# EAGLE design backpac_b (EAGLE 5.12)
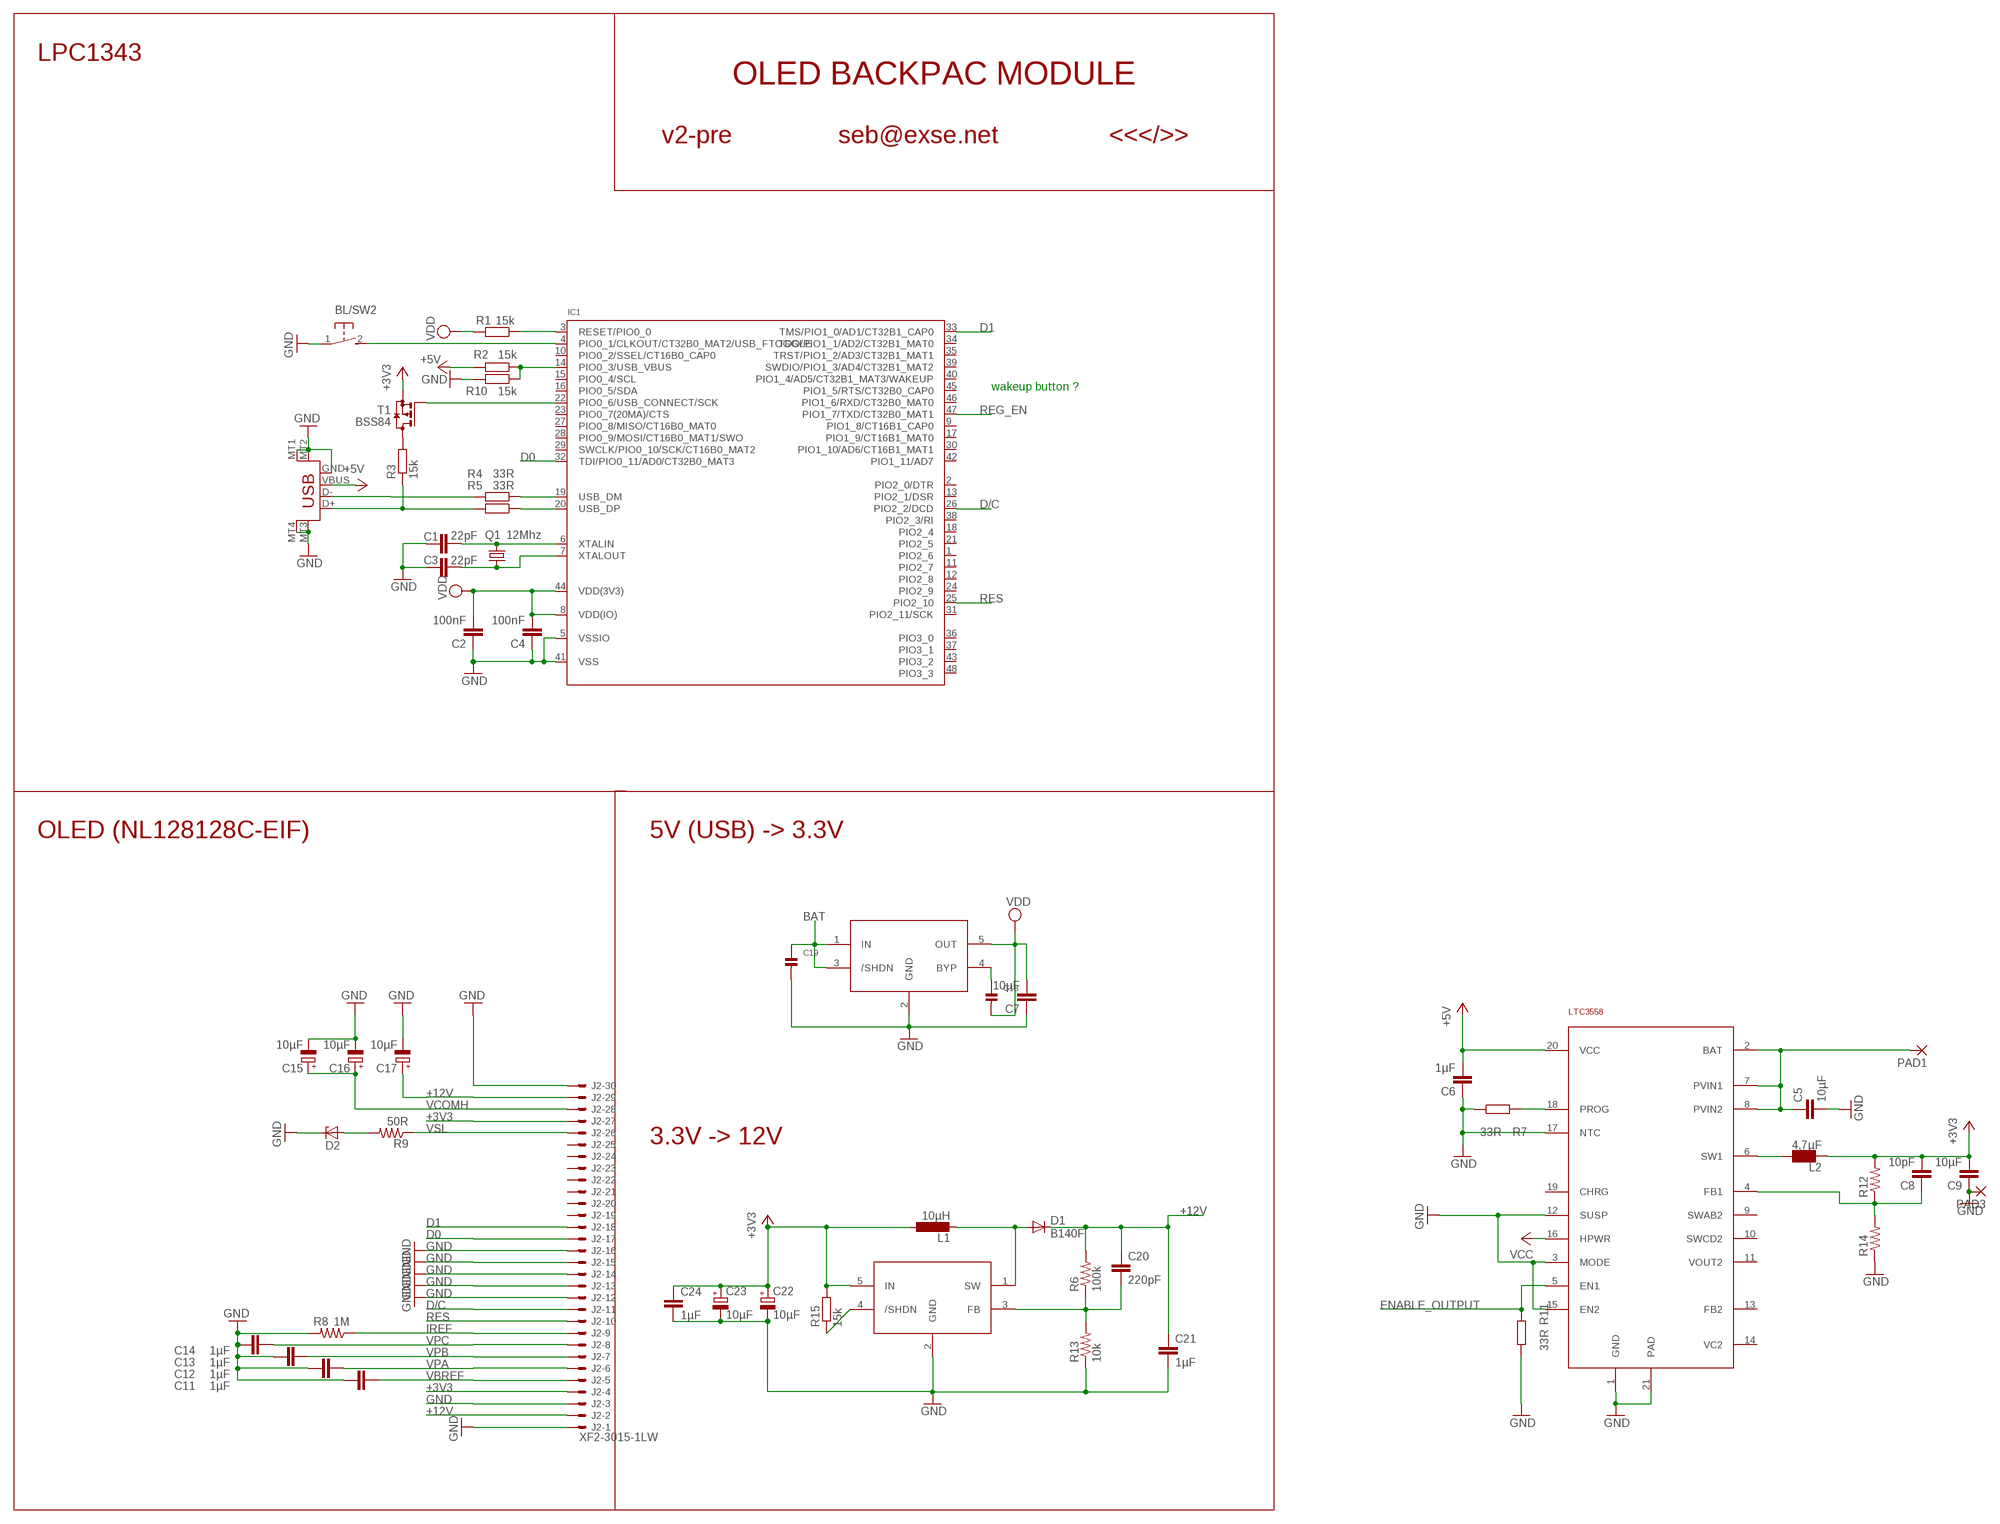
[diagram p0: schematic, sheet 1]

## Parts
BL/SW2  SWITCH_MCTAEF  [SWITCH_MCTAEF]
C1  22pF  C-EUC0402  [C0402]
C2  100nF  C-EUC0402  [C0402]
C3  22pF  C-EUC0402  [C0402]
C4  100nF  C-EUC0402  [C0402]
C5  10µF  CAP0805  [0805]
C6  1µF  CAP0805  [0805]
C7  10µF  CAP0805  [0805]
C8  10pF  CAP0805  [0805]
C9  10µF  CAP0805  [0805]
C11  1µF  CAP0805  [0805]
C12  1µF  CAP0805  [0805]
C13  1µF  CAP0805  [0805]
C14  1µF  CAP0805  [0805]
C15  10µF  CPOL-EUSMCA  [SMC_A]
C16  10µF  CPOL-EUSMCA  [SMC_A]
C17  10µF  CPOL-EUSMCA  [SMC_A]
C18  CAP_CERAMIC0603MINI  [0603-MINI]
C19  CAP_CERAMIC0603MINI  [0603-MINI]
C20  220pF  CAP0805  [0805]
C21  1µF  CAP0805  [0805]
C22  10µF  CPOL-EUSMCA  [SMC_A]
C23  10µF  CPOL-EUSMCA  [SMC_A]
C24  1µF  CAP0805  [0805]
D1  B140F  DIODE-DO214AC  [DO214AC]
D2  ZENER-DIODESOT23  [SOT23]
IC1  LPC1343_QFP  [LQFP48]
IC2  LTC3558  [UD-QFN20]
IC3  LT1761  [SOT23-5L]
IC4  LM27313  [SOT23-5L]
J2  XF2-3015-1LW  [XF2H-3015-1LW]
L1  10µH  L-EUL1812  [L1812]
L2  4,7µF  VLF4012A  [VLF4012A]
PAD1  SMD2  [SMD1,27-2,54]
PAD3  SMD2  [SMD1,27-2,54]
Q1  12Mhz  MT-OSCILLATOR  [MT]
R1  15k  R-EU_R0402  [R0402]
R2  15k  R-EU_R0402  [R0402]
R3  15k  R-EU_R0402  [R0402]
R4  33R  R-EU_R0402  [R0402]
R5  33R  R-EU_R0402  [R0402]
R6  100k  RESISTOR0805-RES  [0805]
R7  33R  R-EU_R0402  [R0402]
R8  1M  RESISTOR0805-RES  [0805]
R9  50R  RESISTOR0805-RES  [0805]
R10  15k  R-EU_R0402  [R0402]
R11  33R  R-EU_R0402  [R0402]
R12  RESISTOR0805-RES  [0805]
R13  10k  RESISTOR0805-RES  [0805]
R14  RESISTOR0805-RES  [0805]
R15  15k  R-EU_R0402  [R0402]
T1  BSS84  [SOT23]
X1  USB-MICROB  [USB-MICROB]

## Nets
+3V3: C8.2 C9.2 C22.+ C23.+ C24.1 IC4.5(IN) J2.4 J2.27 L1.1 L2.P$4 R12.2 R15.2 T1.2(S)
+5V: C6.2 IC2.20(VCC) R2.2 X1.VBUS
+12V: C17.+ C20.1 C21.1 D1.C J2.2 J2.29 R6.2
BAT: C5.1 C19.1 IC2.2(BAT) IC2.7(PVIN1) IC2.8(PVIN2) IC3.1(IN) IC3.3(/SHDN) PAD1.1(P)
D0: IC1.32(TDI/PIO0_11/AD0/CT32B0_MAT3) J2.17
D1: IC1.33(TMS/PIO1_0/AD1/CT32B1_CAP0) J2.18
D/C: IC1.26(PIO2_2/DCD) J2.11
ENABLE_OUTPUT: IC2.5(EN1) R11.2
GND: BL/SW2.1 C1.1 C2.1 C3.1 C4.1 C5.2 C6.1 C7.1 C9.1 C11.1 C12.1 C13.1 C14.1 C15.- C16.- C17.- C19.2 C21.2 C22.- C23.- C24.2 D2.3(C) IC1.5(VSSIO) IC1.41(VSS) IC2.1(GND) IC2.3(MODE) IC2.12(SUSP) IC2.15(EN2) IC2.17(NTC) IC2.21(PAD) IC3.2(GND) IC4.2(GND) J2.1 J2.3 J2.12 J2.13 J2.14 J2.15 J2.16 J2.30 PAD3.1(P) R7.1 R8.2 R10.2 R11.1 R13.1 R14.1 X1.GND X1.MT1(GND) X1.MT2(GND) X1.MT3(GND) X1.MT4(GND)
IREF: J2.9 R8.1
N$1: IC2.18(PROG) R7.2
N$2: D2.1(A) R9.2
N$3: C3.2 IC1.7(XTALOUT) Q1.1
N$4: C1.2 IC1.6(XTALIN) Q1.3
N$5: D1.A IC4.1(SW) L1.2
N$6: C20.2 IC4.3(FB) R6.1 R13.2
N$7: IC1.3(RESET/PIO0_0) R1.1
N$8: R3.2 T1.3(D)
N$9: IC1.22(PIO0_6/USB_CONNECT/SCK) T1.1(G)
N$10: R3.1 R5.2 X1.D+
N$11: R4.2 X1.D-
N$12: IC1.14(PIO0_3/USB_VBUS) R2.1 R10.1
N$13: C8.1 IC2.4(FB1) R12.1 R14.2
N$14: IC1.19(USB_DM) R4.1
N$15: IC2.6(SW1) L2.P$3
N$21: BL/SW2.2 IC1.4(PIO0_1/CLKOUT/CT32B0_MAT2/USB_FTOGGLE)
N$24: IC1.20(USB_DP) R5.1
N$43: C18.1 IC3.4(BYP)
REG_EN: IC1.47(PIO1_7/TXD/CT32B0_MAT1)
REG_EN_: IC4.4(/SHDN) R15.1
RES: IC1.25(PIO2_10) J2.10
VBREF: C11.2 J2.5
VCC: IC2.16(HPWR)
VCOMH: C15.+ C16.+ J2.28
VDD: C2.2 C4.2 C7.2 C18.2 IC1.8(VDD(IO)) IC1.44(VDD(3V3)) IC3.5(OUT) R1.2
VPA: C12.2 J2.6
VPB: C13.2 J2.7
VPC: C14.2 J2.8
VSL: J2.26 R9.1
Unconnected: IC1.1(PIO2_6) IC1.2(PIO2_0/DTR) IC1.9(PIO1_8/CT16B1_CAP0) IC1.10(PIO0_2/SSEL/CT16B0_CAP0) IC1.11(PIO2_7) IC1.12(PIO2_8) IC1.13(PIO2_1/DSR) IC1.15(PIO0_4/SCL) IC1.16(PIO0_5/SDA) IC1.17(PIO1_9/CT16B1_MAT0) IC1.18(PIO2_4) IC1.21(PIO2_5) IC1.23(PIO0_7(20MA)/CTS) IC1.24(PIO2_9) IC1.27(PIO0_8/MISO/CT16B0_MAT0) IC1.28(PIO0_9/MOSI/CT16B0_MAT1/SWO) IC1.29(SWCLK/PIO0_10/SCK/CT16B0_MAT2) IC1.30(PIO1_10/AD6/CT16B1_MAT1) IC1.31(PIO2_11/SCK) IC1.34(TDO/PIO1_1/AD2/CT32B1_MAT0) IC1.35(TRST/PIO1_2/AD3/CT32B1_MAT1) IC1.36(PIO3_0) IC1.37(PIO3_1) IC1.38(PIO2_3/RI) IC1.39(SWDIO/PIO1_3/AD4/CT32B1_MAT2) IC1.40(PIO1_4/AD5/CT32B1_MAT3/WAKEUP) IC1.42(PIO1_11/AD7) IC1.43(PIO3_2) IC1.45(PIO1_5/RTS/CT32B0_CAP0) IC1.46(PIO1_6/RXD/CT32B0_MAT0) IC1.48(PIO3_3) IC2.9(SWAB2) IC2.10(SWCD2) IC2.11(VOUT2) IC2.13(FB2) IC2.14(VC2) IC2.19(CHRG) J2.19 J2.20 J2.21 J2.22 J2.23 J2.24 J2.25

## Notes on the sheet
- LPC1343
- OLED BACKPAC MODULE
- v2-pre | seb@exse.net | <<</>>
- wakeup button ?
- OLED (NL128128C-EIF) | 5V (USB) -> 3.3V
- 3.3V -> 12V

## Library data of the parts
BL/SW2 = seb:SWITCH_MCTAEF
C1-C4 = rcl:C-EU: CAPACITOR, European symbol
C5-C9 C11-C14 C20 C21 C24 = SparkFun:CAP: Capacitor Standard 0603 ceramic capacitor, and 0.1" leaded capacitor.
C15-C17 C22 C23 = rcl:CPOL-EU: POLARIZED CAPACITOR, European symbol
C18 C19 = microbuilder:CAP_CERAMIC: Ceramic Capacitors 0402 - 0402 Surface Mount Capacitors 16pF 50V 5% [Digikey: 445-4899-2-ND] 18pF 50V 5% [Digikey: 490-1281-2-ND] 22pF 50V 5% [Digikey: 490-1283-2-ND] 68pF 50V 5% [Digikey: 490-1289-2-ND] 0.1uF 10V 10% [Digikey: 490-1318-2-ND] 1.0uF 6.3V 10% [Digikey: 490-1320-2-ND] 0603 - 0603 Surface Mount Capacitors 16 pF 50V 5% [Digikey: 445-5051-2-ND] 22 pF 50V [Digikey: PCC220ACVTR-ND] 33 pF 50V 5% [Digikey: 490-1415-1-ND] 56pF 50V 5% [Digikey: 490-1421-1-ND] 220pF 50V 5% [Digikey: 445-1285-1-ND] 680 pF 50V 2200 pF 50V 5% C0G [Digikey: 445-1297-1-ND] 5600 pF 100V 5% X7R [Digikey: 478-3711-1-ND] 0.1 µF 25V 10% [Digikey: PCC2277TR-ND] 0.22 µF 16V 10% X7R [Digikey: 445-1318-1-ND] 1.0 µF 25V 10% [Digikey: 445-5146-2-ND] 0603 - RF Specific 3pF 250V +/-0.1pF RF [Digikey: 712-1347-1-ND] 18 pF 250V 5% [Digikey: 478-3505-1-ND or 712-1322-1-ND] 56 pF 250V 5% C0G RF [Digikey: 490-4867-1-ND] 68 pF 250V RF [Digikey: 490-4868-1-ND] 0805 - 0805 Surface Mount Capacitors 220 pF 250V 2% RF Ceramic Capacitor [Digikey: 712-1398-1-ND] 1000 pF 50V 2% NP0 Ceramic Capacitor [Digikey: 478-3760-1-ND] 0.1 µF 25V 10% Ceramic Capacitor [Digikey: PCC1828TR-ND] 1.0 µF 16V 10% Ceramic Capacitor[Digikey: 490-1691-2-ND] 10.0 µF 10V 10% Ceramic Capacitor[Digikey: 709-1228-1-ND] 10.0 uF 16V 10% Ceramic Capacitor [Digikey: 478-5165-2-ND] 47 uF 6.3V 20% Ceramic Capacitor [Digikey: 587-1779-1-ND or 399-5506-1-ND] 1206 - 1206 Surface Mount Capacitors 47uF 10V 20% Ceramic Capacitor [Digikey: 490-5528-1-ND or 399-5508-1-ND or 445-6010-1-ND]
D1 = diode:DIODE-: DIODE
D2 = diode:ZENER-DIODE: Z-Diode
IC1 = microbuilder:LPC1343_QFP: LPC1343 72 MHz 32-bit ARM Cortex-M3 microcontroller. 32 kB Flash, 8 kB SRAM, USB Device Mouser: 771-LPC1343FBD48151 Digikey: 568-4945-ND; DIGIKEY#: 568-4945-ND; MANF: NXP; MANF#: LPC1343FBD48,151
IC2 = seb:LTC3558
IC3 = seb:LT1761
IC4 = seb:LM27313
J2 = con-omron:XF2*-30?: OMRON FPC Connector Source : http://www.omron.com/ecb/products/pdf/fpc.pdf; OC_FARNELL: unknown; OC_NEWARK: unknown
L1 = resistor:L-EU: INDUCTOR, European symbol
L2 = seb:VLF4012A
PAD1 PAD3 = wirepad:SMD2: SMD PAD
Q1 = seb:MT-OSCILLATOR
R1-R5 R7 R10 R11 R15 = rcl:R-EU_: RESISTOR, European symbol
R6 R8 R9 R12-R14 = SparkFun:RESISTOR: Resistor Basic schematic elements and footprints for 0603, 1206, and PTH resistors.
T1 = transistor-small-signal:BSS84: P-CHANNEL MOS FET
X1 = SparkFun:USB: USB Connectors USB-B-PTH is fully proven SKU : PRT-00139 USB-miniB is fully proven SKU : PRT-00587 USB-A-PCB is untested. USB-A-H is throughly reviewed, but untested. Spark Fun Electronics SKU : PRT-00437 USB-B-SMT is throughly reviewed, but untested. Needs silkscreen touching up. USB-A-S has not been used/tested USB-MB-H has not been used/tested

## Board
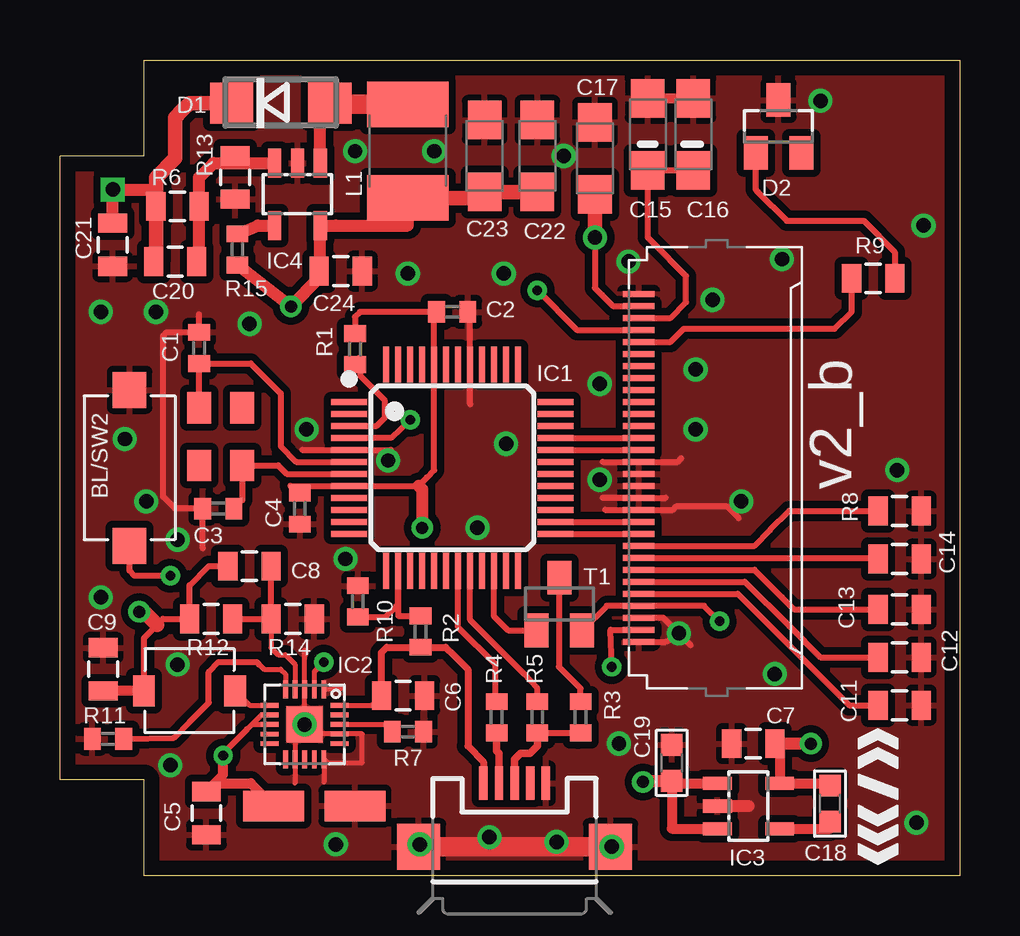
[diagram p1: board, top side]
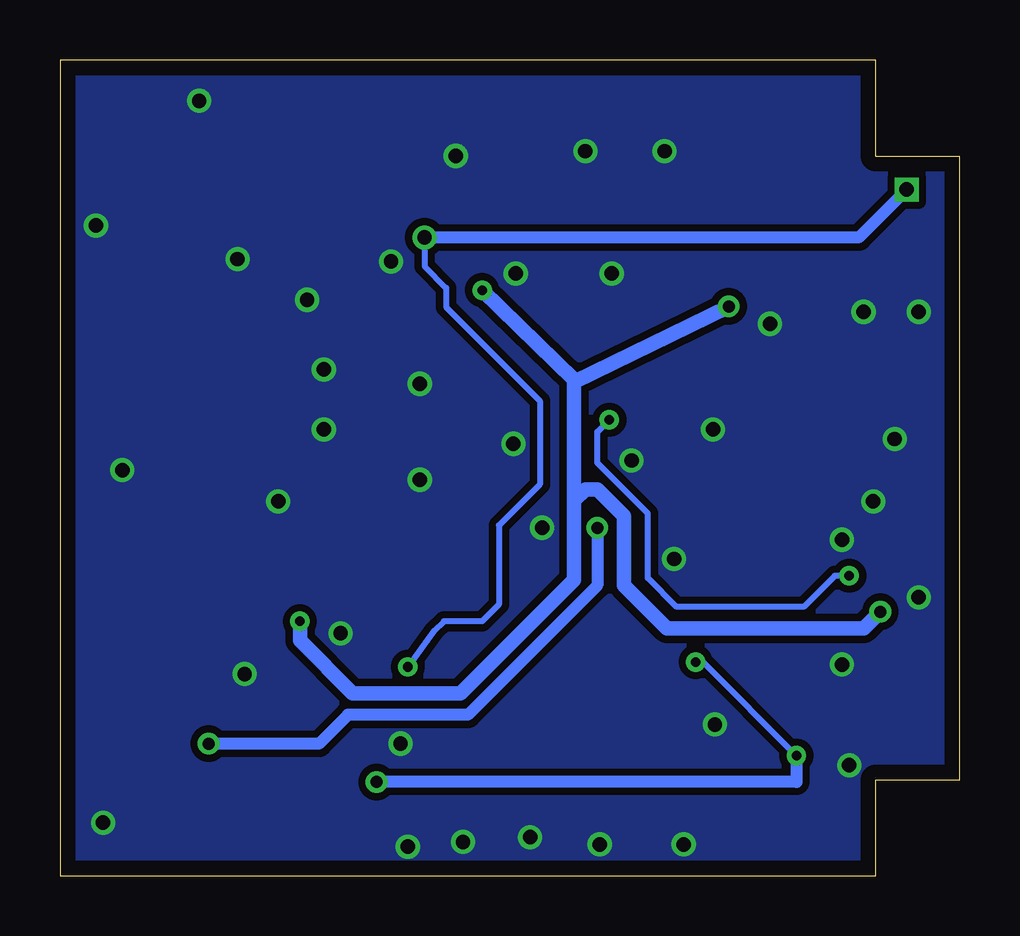
[diagram p2: board, bottom side, seen from below]

Size 37.5 x 34 mm. Coordinates in mm from the lower left corner, seen from the top.
Outline: 37.5,34 37.5,0 3.5,0 3.5,4 0,4 0,30 3.5,30 3.5,34 37.5,34
Copper layers (1*16): Top 0.035mm / dielectric 1.5mm / Bottom 0.035mm
Design rules "default *": minimum track width 9mil, minimum drill 0.4mm, track to track 8mil, track to pad 8mil, pad to pad 8mil, via to via 8mil, smd to smd 8mil, copper to edge 25mil, drill to drill 8mil, minimum pad ring 10mil, minimum via ring 8mil, stop-mask expansion 4mil, vias tented up to drill 30mil, thermal gap 10mil

### Footprints (pad centres in the part's own frame; a part is rotated, then mirrored left to right if it is on the bottom)
SWITCH_MCTAEF = smd 1.5 x 1.4: 1 -3.25,0; 2 3.25,0
C0402 = smd 0.7 x 0.9: 1 -0.65,0; 2 0.65,0
0805 = smd 0.8 x 1.2: 1 -0.9,0; 2 0.9,0
SMC_A = smd 1.6 x 1.4: + -1.5,0; - 1.5,0
0603-MINI = smd 0.9 x 0.9: 1 -0.75,0; 2 0.75,0
DO214AC = smd 1.8 x 1.7: A 2.05,0; C -2.05,0
SOT23 = smd 1 x 1.4: 1 -0.95,-1.1; 2 0.95,-1.1; 3 0,1.1
LQFP48 = smd 1.5 x 0.25: 1 -4.3,2.75; 2 -4.3,2.25; 3 -4.3,1.75; 4 -4.3,1.25; 5 -4.3,0.75; 6 -4.3,0.25; 7 -4.3,-0.25; 8 -4.3,-0.75; 9 -4.3,-1.25; 10 -4.3,-1.75; 11 -4.3,-2.25; 12 -4.3,-2.75; 25 4.3,-2.75; 26 4.3,-2.25; 27 4.3,-1.75; 28 4.3,-1.25; 29 4.3,-0.75; 30 4.3,-0.25; 31 4.3,0.25; 32 4.3,0.75; 33 4.3,1.25; 34 4.3,1.75; 35 4.3,2.25; 36 4.3,2.75 | smd 0.25 x 1.5: 13 -2.75,-4.3; 14 -2.25,-4.3; 15 -1.75,-4.3; 16 -1.25,-4.3; 17 -0.75,-4.3; 18 -0.25,-4.3; 19 0.25,-4.3; 20 0.75,-4.3; 21 1.25,-4.3; 22 1.75,-4.3; 23 2.25,-4.3; 24 2.75,-4.3; 37 2.75,4.3; 38 2.25,4.3; 39 1.75,4.3; 40 1.25,4.3; 41 0.75,4.3; 42 0.25,4.3; 43 -0.25,4.3; 44 -0.75,4.3; 45 -1.25,4.3; 46 -1.75,4.3; 47 -2.25,4.3; 48 -2.75,4.3
UD-QFN20 = smd 0.751 x 0.2: 1 -1.451,0.8; 2 -1.451,0.4; 3 -1.451,0; 4 -1.451,-0.4; 5 -1.451,-0.8; 11 1.451,-0.8; 12 1.451,-0.4; 13 1.451,0; 14 1.451,0.4; 15 1.451,0.8 | smd 0.2 x 0.751: 6 -0.8,-1.451; 7 -0.4,-1.451; 8 0,-1.451; 9 0.4,-1.451; 10 0.8,-1.451; 16 0.8,1.451; 17 0.4,1.451; 18 0,1.451; 19 -0.4,1.451; 20 -0.8,1.451 | smd 1.5 x 1.5: 21 0,0
SOT23-5L = smd 0.55 x 1.2: 1 -0.95,-1.3; 2 0,-1.3; 3 0.95,-1.3; 4 0.95,1.3; 5 -0.95,1.3
XF2H-3015-1LW = smd 1.3 x 0.25: 1 3.175,7.25; 2 3.175,6.75; 3 3.175,6.25; 4 3.175,5.75; 5 3.175,5.25; 6 3.175,4.75; 7 3.175,4.25; 8 3.175,3.75; 9 3.175,3.25; 10 3.175,2.75; 11 3.175,2.25; 12 3.175,1.75; 13 3.175,1.25; 14 3.175,0.75; 15 3.175,0.25; 16 3.175,-0.25; 17 3.175,-0.75; 18 3.175,-1.25; 19 3.175,-1.75; 20 3.175,-2.25; 21 3.175,-2.75; 22 3.175,-3.25; 23 3.175,-3.75; 24 3.175,-4.25; 25 3.175,-4.75; 26 3.175,-5.25; 27 3.175,-5.75; 28 3.175,-6.25; 29 3.175,-6.75; 30 3.175,-7.25
L1812 = smd 1.9 x 3.4: 1 -1.95,0; 2 1.95,0
VLF4012A = smd 0.9 x 1.3: P$3 -1.9,0; P$4 1.9,0
SMD1,27-2,54 = smd 1.27 x 2.54: 1 0,0
MT = smd 1.3 x 1: 1 1.2,0.9; 2 -1.2,0.9; 3 -1.2,-0.9; 4 1.2,-0.9
R0402 = smd 0.7 x 0.9: 1 -0.65,0; 2 0.65,0
USB-MICROB = smd 0.35 x 1.4: D+ 0,2.65; D- -0.65,2.65; GND 1.3,2.65; ID 0.65,2.65; VBUS -1.3,2.65 | smd 1.8 x 1.9: MT1 -4,0; MT2 4,0; MT3 -4,0; MT4 4,0

### Placement (x,y rotation side)
BL/SW2  2.9,17 270 top
C1  5.8,22 270 top
C2  16.35,23.5 180 top
C3  6.6,15.3 0 top
C4  10,15.3 90 top
C5  6.1,2.6 270 top
C6  14.3,7.5 180 top
C7  28.9,5.5 0 top
C8  7.9,12.9 180 top
C9  1.8,8.6 270 top
C11  35,7.1 180 top
C12  35,9.1 180 top
C13  35,11.1 180 top
C14  35,13.2 180 top
C15  24.5,30.9 90 top
C16  26.4,30.9 90 top
C17  22.3,29.9 90 top
C18  32.1,3 90 top
C19  25.5,4.7 90 top
C20  4.8,25.6 0 top
C21  2.2,26.3 270 top
C22  19.9,30 90 top
C23  17.7,30 90 top
C24  11.7,25.2 0 top
D1  9.2,32.2 0 top
D2  29.95,31.23 0 top
IC1  16.35,17 0 top
IC2  10.2,6.3 270 top
IC3  28.7,2.9 270 top
IC4  9.9,28.4 180 top
J2  27.3,17 180 top
L1  14.5,30.2 90 top
L2  5.4,7.7 180 top
PAD1  8.9,2.9 90 top
PAD3  12.3,2.9 90 top
Q1  6.7,18.3 270 top
R1  12.3,21.95 90 top
R2  15.03,10.17 270 top
R3  21.7,6.6 90 top
R4  18.2,6.6 270 top
R5  19.9,6.6 270 top
R6  4.9,27.9 180 top
R7  14.5,6 180 top
R8  35,15.2 0 top
R9  33.9,24.9 0 top
R10  12.42,11.43 90 top
R11  2,5.7 0 top
R12  6.3,10.7 180 top
R13  7.3,29.1 90 top
R14  9.7,10.7 180 top
R15  7.4,26.1 270 top
T1  20.82,11.32 0 top
X1  18.95,1.2 0 top

### Tracks (layer width: path | path; a pad name or v marks a point on that pad's centre or on a via)
+3V3  (via drill 0.4, 0.5)
  Top 0.254: v27.5,10.6 26.85,11.25 J2.4 22.8,11.25 T1.2 | C8.2 6.2,12.9 5.4,12.1 R12.2 4.3,10.7 4.05,10.45 3.5,9.9 L2.P$4 | J2.27 21.55,22.75 v19.9,24.4
  Top 0.406: L2.P$4 C9.2
  Top 0.5: IC4.5 14.5,27.1 L1.1 | R15.2 7.5,25.4 7.58,25.32 v9.62,23.73 10.8,24.9 C24.1 10.85,25.25 IC4.5 | IC4.5 11.5,27.1
  Top 0.61: C22.+ C23.+ 17.45,28.25 L1.1 | v3.3,11 3.5,11 4.05,10.45
  Bottom 0.61: v27.5,10.6 27.5,9.8 25.3,7.6 20.8,7.6 16.07,12.33 16.07,15.63 | 16.07,20.67 v19.9,24.4 | 16.07,15.63 16.07,20.67 | v9.62,23.73 16.08,20.57 16.07,20.67 | 16.07,15.63 15.6,16.1 15.1,16.1 14,15 14,12.1 12.2,10.3 4,10.3 v3.3,11
+5V
  Top 0.2: IC2.20 13,7.1 C6.2
  Top 0.3: X1.VBUS 17.65,4.75 17,5.4 17,8.6 16.4,9.2 16.08,9.52 R2.2 13.62,9.52 13.5,9.4 13.4,9.3 C6.2
+12V  (via drill 0.4, 0.6)
  Top 0.254: 22.95,10.25 v23,8.7 22.95,10.25 | 22.95,10.25 J2.2 | J2.29 23.05,23.75 22.6,24.2 22.3,24.5 v22.3,26.6
  Top 0.406: v22.3,26.6 C17.+
  Top 0.5: D1.C 6.85,32.1 | C21.1 v2.2,28.6 4,28.6 4,25.7
  Top 0.61: v22.3,26.6 C17.+ | C20.1 4,25.7 R6.2 4,29.1 4.8,29.9 4.8,31.6 5.1,31.9 5.4,32.2 D1.C
  Bottom 0.254: v23,8.7 21.9,10.2 21.5,10.6 19.9,10.6 19.2,11.3 19.2,14.6 17.49,16.31 17.49,19.79 21.4,23.7 21.4,24.5 22.3,25.4 v22.3,26.6
  Bottom 0.5: v2.2,28.6 4.2,26.6 v22.3,26.6
BAT  (via drill 0.4, 0.5)
  Top 0.2: IC2.8 8,6.3 7.8,6.1 8.4,6.7 IC2.7 | IC2.2 10.6,8.5 v11,8.9
  Top 0.254: 7.8,6.1 6.8,5.1 v6.8,5
  Top 0.406: IC3.3 25.5,1.95 C19.1 25.5,3.85 IC3.1 | C5.1 6.45,3.85 | 6.45,3.85 6.8,4.2 v6.8,5 | PAD1.1 7.95,3.85 6.45,3.85
  Top 0.5: C19.1 24.3,3.95 v24.3,3.9
  Bottom 0.254: v11,8.9 10.7,8.9 v6.8,5
  Bottom 0.5: v24.3,3.9 6.8,3.9 v6.8,5
D0
  Top 0.254: IC1.32 J2.17
D1
  Top 0.254: IC1.33 J2.18
D/C
  Top 0.254: IC1.26 J2.11
ENABLE_OUTPUT
  Top 0.2: IC2.5 9.4,8.4 9.2,8.6 8.5,8.6 8.3,8.8
  Top 0.254: 8.3,8.8 8.2,8.9 6.6,8.9 6.2,8.5 6.2,7.2 5.4,6.4 4.75,5.75 R11.2
GND  (via drill 0.6)
  Top 0.2: IC2.21 IC2.3 10.2,9.4 | IC2.1 11.7,7.8 | IC2.21 10.6,5.9 IC2.17 12.6,5.9 12.6,4.7 11.15,4.7 IC2.15 11,3.9 | IC2.21 9.8,5.9 9.8,4.9 IC2.12 9.8,3.85
  Top 0.254: 17.1,19.65 IC1.41 17.1,23.4 C2.1 | 5.95,13.65 C3.1 4.8,15.3 4.3,15.8 4.3,22.5 4.45,22.65 C1.1 5.8,23.4 | 10.1,17.75 IC1.5 13.8,17.75 13.45,17.3 v13.68,17.3 | J2.1 25.25,9.75 v25.8,10.1 26.1,9.8 | J2.3 25.15,10.75 26.3,9.6 | 25.9,17.4 25.75,17.25 24.25,17.25 J2.16 22.62,17.25 | 22.62,15.75 23.62,15.75 J2.13 24.25,15.75 25.25,15.75 | 28.3,14.9 27.8,15.4 25.7,15.4 25.55,15.25 24.15,15.25 J2.12 22.73,15.25
  Top 0.406: C15.- C16.-
  Top 0.5: IC3.2 28.7,2.9
  Top 0.813: X1.MT1 X1.MT4
  other vias: 31.7,32.3 30.1,25.7 14.5,25.1 1.7,23.5 7.9,23 12.3,30.2 4.9,14 11.9,13.2 17.4,14.5 1.7,11.6 17.9,1.6 20.7,1.4 35.7,2.2 36,27.1 27.2,24 23.7,25.6 22.5,20.5 11.5,1.3 23,1.2 15,1.3 34.9,16.9 4.6,4.6 18.5,25.1 10.28,18.6 4.9,8.8 29.8,8.4 4,23.5 2.7,18.2 23.3,5.5 18.6,18 3.6,15.6 26.5,21.1 26.5,18.6 22.5,16.5 28.4,15.6 15.6,30.2 21,30 10.2,6.3
  pour Top (isolate 0.305): 38,34.5 0,34.5 0,-0.5 38,-0.5
  pour Bottom (isolate 0.305): 38,34.5 0,34.5 0,-0.5 38,-0.5
IREF
  Top 0.254: J2.9 28.95,13.75 29.6,14.4 30.4,15.2 R8.1
N$1
  Top 0.2: IC2.18 13.85,6.3 R7.2
N$2
  Top 0.254: R9.2 34.8,26 33.5,27.3 30.3,27.3 29.1,28.5 29,28.6 D2.1
N$3
  Top 0.254: IC1.7 9.45,16.75 9.1,17.1 Q1.1 7.6,15.65 C3.2
N$4
  Top 0.254: IC1.6 9.85,17.25 9.2,17.9 9.2,20.1 7.95,21.35 C1.2 Q1.3
N$5
  Top 0.5: IC4.1 10.85,32.2 D1.A
  Top 0.813: L1.2 11.05,32.15 D1.A
N$6
  Top 0.5: 7.3,29.7 IC4.3 | 7.3,29.7 R13.2 | 7.3,29.7 6.4,29.7 5.8,29.1 5.8,28.4 | 5.8,28.4 R6.1 | C20.2 5.8,25.7 5.8,28.4
N$7
  Top 0.254: IC1.3 13.2,18.75 13.55,19.1 13.55,19.8 12.53,20.82 12.47,21.57 R1.1
N$8
  Top 0.254: R3.2 21.7,7.8 20.8,8.7 20.82,8.72 T1.3
N$9
  Top 0.254: T1.1 18.68,10.22 18.4,10.5 18.1,10.8 IC1.22
N$10
  Top 0.254: R3.1 21.7,5.9 21.6,5.7 21.35,5.95 R5.2
  Top 0.305: X1.D+ 18.95,4.85 19.2,5.1 19.6,5.1 19.8,5.3 19.9,5.4 R5.2
N$11
  Top 0.305: X1.D- 18.3,5.1 18.2,5.2 R4.2
N$12
  Top 0.254: R10.1 13.58,10.78 14,11.2 14.1,11.3 14.1,12 | 14.1,12 IC1.14 | R2.1 14.1,10.83 14.1,12
N$13
  Top 0.2: IC2.4 9.8,8.8 9.4,9.2 9.1,9.2 8.8,9.5 R14.2
  Top 0.254: R12.1 R14.2 C8.1
N$14
  Top 0.254: R4.1 18.15,7.55 18.15,8.8 16.6,10.35 IC1.19
N$15
  Top 0.2: IC2.6 7.9,7.1 L2.P$3
N$21  (via drill 0.4)
  Top 0.254: IC1.4 13.8,18.25 v14.6,19 | BL/SW2.2 2.9,12.7 3.1,12.5 3.7,12.5 v4.6,12.5
  Bottom 0.254: v4.6,12.5 5.2,12.5 6.5,11.2 11.8,11.2 13,12.4 13,15.1 15.1,17.2 15.1,18.5 v14.6,19 14.4,18.8
N$24
  Top 0.254: IC1.20 17.1,10.65 19.35,8.4 19.9,7.8 R5.1
N$43
  Top 0.406: IC3.4 32.1,1.95 C18.1
REG_EN_
  Top 0.5: R15.1 8.25,27.1 IC4.4
RES
  Top 0.254: IC1.25 J2.10
VBREF
  Top 0.254: J2.5 28.25,11.75 31.9,8.1 32.9,7.1 C11.2
VCOMH
  Top 0.254: C16.+ C15.+ 24.5,26.6 24.7,26.4 26.1,25 26.1,23.9 25.45,23.25 J2.28
VDD  (via drill 0.5)
  Top 0.254: C4.2 9.6,16.25 IC1.8 14.95,16.25 15.3,16.6 15.6,16.9 IC1.44 15.6,23.4 C2.2 12.5,23.5 12.3,23.3 R1.2
  Top 0.406: C7.2 30,5.5 IC3.5 32.1,3.85 C18.2
  Top 0.5: v31.3,5.5 C7.2 | v15.1,14.5 15.1,16.1 14.95,16.25
  Bottom 0.5: v31.3,5.5 26.7,5.5 25.5,6.7 20.5,6.7 15.1,12.1 v15.1,14.5
VPA
  Top 0.254: J2.6 28.55,12.25 30.4,10.4 31.7,9.1 C12.2
VPB
  Top 0.254: J2.7 28.95,12.75 30.1,11.6 30.6,11.1 C13.2
VPC
  Top 0.254: J2.8 34.05,13.25 C14.2
VSL
  Top 0.254: R9.1 33,23.5 32.3,22.8 26,22.8 25.45,22.25 J2.26

### Text on the board
tPlace: v2_b
tValues: LPC1343 | 12Mhz
bStop: seb@exse.net | oled module v1